# EAGLE design SmartMatrixPhotonApa (EAGLE 7.4.0)
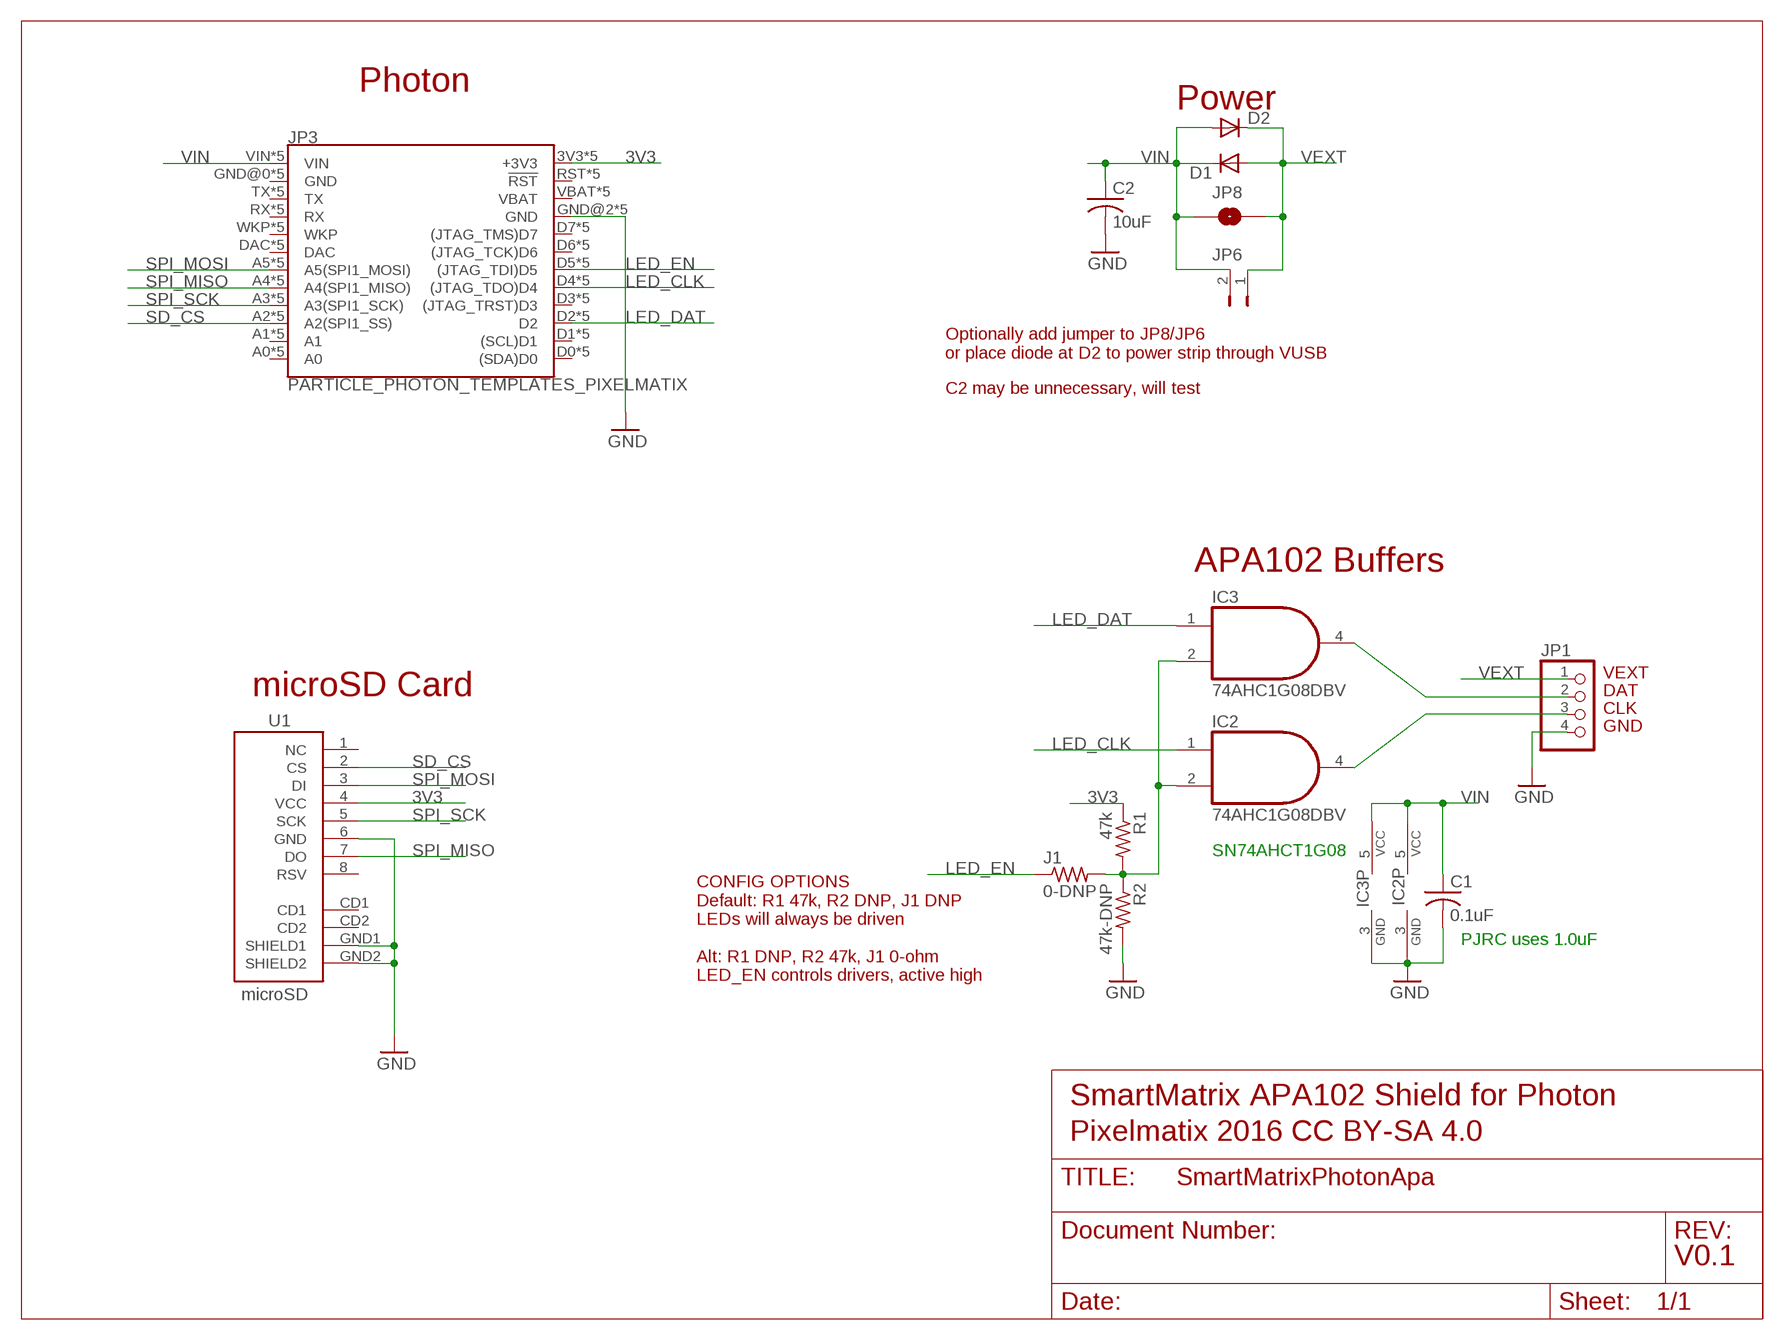
[diagram p0: schematic, sheet 1]

## Parts
C1  0.1uF  C-USC0603  [C0603]
C2  10uF  C-USC0805  [C0805]
D1  MBR0520LT  [SOD123]
D2  MBR0520LT  [SOD123]
IC2  74AHC1G08DBV  [SOT23-5]
IC3  74AHC1G08DBV  [SOT23-5]
J1  0-DNP  R-US_R0603  [R0603]
JP1  PINHD-1X04_2.54  [1X04]
JP3  PARTICLE_PHOTON_TEMPLATES_PIXELMATIX  [PIXELMATIX_PHOTON_SHIELD_TEMPLATE]
JP6  JUMPER-PTH-2-NO  [PTH-JUMPER-2-NO_NO_SILK]
JP8  JUMPER-PAD-2-NO  [PAD-JUMPER-2-NO_NO_SILK]
R1  47k  R-US_R0603  [R0603]
R2  47k-DNP  R-US_R0603  [R0603]
U1  microSD  USD-SOCKETSMD  [MICRO-SD-SOCKET-PP]

## Nets
3V3: JP3.3V3(+3V3) JP3.3V3_1(+3V3) JP3.3V3_2(+3V3) JP3.3V3_S1(+3V3) JP3.3V3_S2(+3V3) R1.1 U1.4(VCC)
CLK: IC2.4(O) JP1.3
DAT: IC3.4(O) JP1.2
GND: C1.2 C2.2 IC2.3(GND) IC3.3(GND) JP1.4 JP3.GND@2(GND) JP3.GND@2_1(GND) JP3.GND@2_2(GND) JP3.GND@2_S1(GND) JP3.GND@2_S2(GND) R2.2 U1.6(GND) U1.GND1(SHIELD1) U1.GND2(SHIELD2)
LED_CLK: IC2.1(I0) JP3.D4((JTAG_TDO)D4) JP3.D4_1((JTAG_TDO)D4) JP3.D4_2((JTAG_TDO)D4) JP3.D4_S1((JTAG_TDO)D4) JP3.D4_S2((JTAG_TDO)D4)
LED_DAT: IC3.1(I0) JP3.D2 JP3.D2_1(D2) JP3.D2_2(D2) JP3.D2_S1(D2) JP3.D2_S2(D2)
LED_EN: J1.1 JP3.D5((JTAG_TDI)D5) JP3.D5_1((JTAG_TDI)D5) JP3.D5_2((JTAG_TDI)D5) JP3.D5_S1((JTAG_TDI)D5) JP3.D5_S2((JTAG_TDI)D5)
N$4: IC2.2(I1) IC3.2(I1) J1.2 R1.2 R2.1
SD_CS: JP3.A2(A2(SPI1_SS)) JP3.A2_1(A2(SPI1_SS)) JP3.A2_2(A2(SPI1_SS)) JP3.A2_S1(A2(SPI1_SS)) JP3.A2_S2(A2(SPI1_SS)) U1.2(CS)
SPI_MISO: JP3.A4(A4(SPI1_MISO)) JP3.A4_1(A4(SPI1_MISO)) JP3.A4_2(A4(SPI1_MISO)) JP3.A4_S1(A4(SPI1_MISO)) JP3.A4_S2(A4(SPI1_MISO)) U1.7(DO)
SPI_MOSI: JP3.A5(A5(SPI1_MOSI)) JP3.A5_1(A5(SPI1_MOSI)) JP3.A5_2(A5(SPI1_MOSI)) JP3.A5_S1(A5(SPI1_MOSI)) JP3.A5_S2(A5(SPI1_MOSI)) U1.3(DI)
SPI_SCK: JP3.A3(A3(SPI1_SCK)) JP3.A3_1(A3(SPI1_SCK)) JP3.A3_2(A3(SPI1_SCK)) JP3.A3_S1(A3(SPI1_SCK)) JP3.A3_S2(A3(SPI1_SCK)) U1.5(SCK)
VEXT [power]: D1.A D2.C JP1.1 JP6.1 JP8.2
VIN [power]: C1.1 C2.1 D1.C D2.A IC2.5(VCC) IC3.5(VCC) JP3.VIN JP3.VIN1(VIN) JP3.VIN2(VIN) JP3.VIN_S1(VIN) JP3.VIN_S2(VIN) JP6.2 JP8.1
Unconnected: JP3.A0 JP3.A0_1(A0) JP3.A0_2(A0) JP3.A0_S1(A0) JP3.A0_S2(A0) JP3.A1 JP3.A1_1(A1) JP3.A1_2(A1) JP3.A1_S1(A1) JP3.A1_S2(A1) JP3.D0((SDA)D0) JP3.D0_1((SDA)D0) JP3.D0_2((SDA)D0) JP3.D0_S1((SDA)D0) JP3.D0_S2((SDA)D0) JP3.D1((SCL)D1) JP3.D1_1((SCL)D1) JP3.D1_2((SCL)D1) JP3.D1_S1((SCL)D1) JP3.D1_S2((SCL)D1) JP3.D3((JTAG_TRST)D3) JP3.D3_1((JTAG_TRST)D3) JP3.D3_2((JTAG_TRST)D3) JP3.D3_S1((JTAG_TRST)D3) JP3.D3_S2((JTAG_TRST)D3) JP3.D6((JTAG_TCK)D6) JP3.D6_1((JTAG_TCK)D6) JP3.D6_2((JTAG_TCK)D6) JP3.D6_S1((JTAG_TCK)D6) JP3.D6_S2((JTAG_TCK)D6) JP3.D7((JTAG_TMS)D7) JP3.D7_1((JTAG_TMS)D7) JP3.D7_2((JTAG_TMS)D7) JP3.D7_S1((JTAG_TMS)D7) JP3.D7_S2((JTAG_TMS)D7) JP3.DAC JP3.DAC_1(DAC) JP3.DAC_2(DAC) JP3.DAC_S1(DAC) JP3.DAC_S2(DAC) JP3.GND@0(GND) JP3.GND@0_1(GND) JP3.GND@0_2(GND) JP3.GND@0_S1(GND) JP3.GND@0_S2(GND) JP3.RST(!RST!) JP3.RST_1(!RST!) JP3.RST_2(!RST!) JP3.RST_S1(!RST!) JP3.RST_S2(!RST!) JP3.RX JP3.RX_1(RX) JP3.RX_2(RX) JP3.RX_S1(RX) JP3.RX_S2(RX) JP3.TX JP3.TX_1(TX) JP3.TX_2(TX) JP3.TX_S1(TX) JP3.TX_S2(TX) JP3.VBAT JP3.VBAT_1(VBAT) JP3.VBAT_2(VBAT) JP3.VBAT_S1(VBAT) JP3.VBAT_S2(VBAT) JP3.WKP JP3.WKP_1(WKP) JP3.WKP_2(WKP) JP3.WKP_S1(WKP) JP3.WKP_S2(WKP) U1.1(NC) U1.8(RSV) U1.CD1 U1.CD2

## Notes on the sheet
- Photon
- Power
- Optionally add jumper to JP8/JP6
  or place diode at D2 to power strip through VUSB
- C2 may be unnecessary, will test
- APA102 Buffers
- VEXT
- microSD Card | DAT
- CLK
- GND
- SN74AHCT1G08
- PJRC uses 1.0uF
- CONFIG OPTIONS
  Default: R1 47k, R2 DNP, J1 DNP
  LEDs will always be driven
  
  Alt: R1 DNP, R2 47k, J1 0-ohm
  LED_EN controls drivers, active high
- SmartMatrix APA102 Shield for Photon
- Pixelmatix 2016 CC BY-SA 4.0
- V0.1

## Library data of the parts
C1 C2 = scanlime:C-US: CAPACITOR, American symbol; PARTNO: CAP CER 0.1UF 10V 10% X7R 0805
D1 D2 = diode:MBR0520LT: SCHOTTKY BARRIER RECTIFIER Source: http://onsemi.com .. MBR0520LT1-D.pdf
IC2 IC3 = 74xx-little-us:74*1G08: 2-input AND gate
J1 R1 R2 = rcl:R-US_: RESISTOR, American symbol
JP1 = pinhead-2:PINHD-1X04: PIN HEADER
JP3 = eclibrary:PARTICLE_PHOTON_TEMPLATES
JP6 = SparkFun-Passives:JUMPER-PTH-2-NO
JP8 = SparkFun-Passives:JUMPER-PAD-2-NO
U1 = SparkFun:USD-SOCKET: microSD Socket Push-push type uSD socket. Schematic element and footprint production proven. Spark Fun Electronics SKU : PRT-00127. tDoc lines correctly indicate media card edge positions when inserting (unlocked, locked, depressed).

## Net classes
1 power: width 0.406 mm

## Board
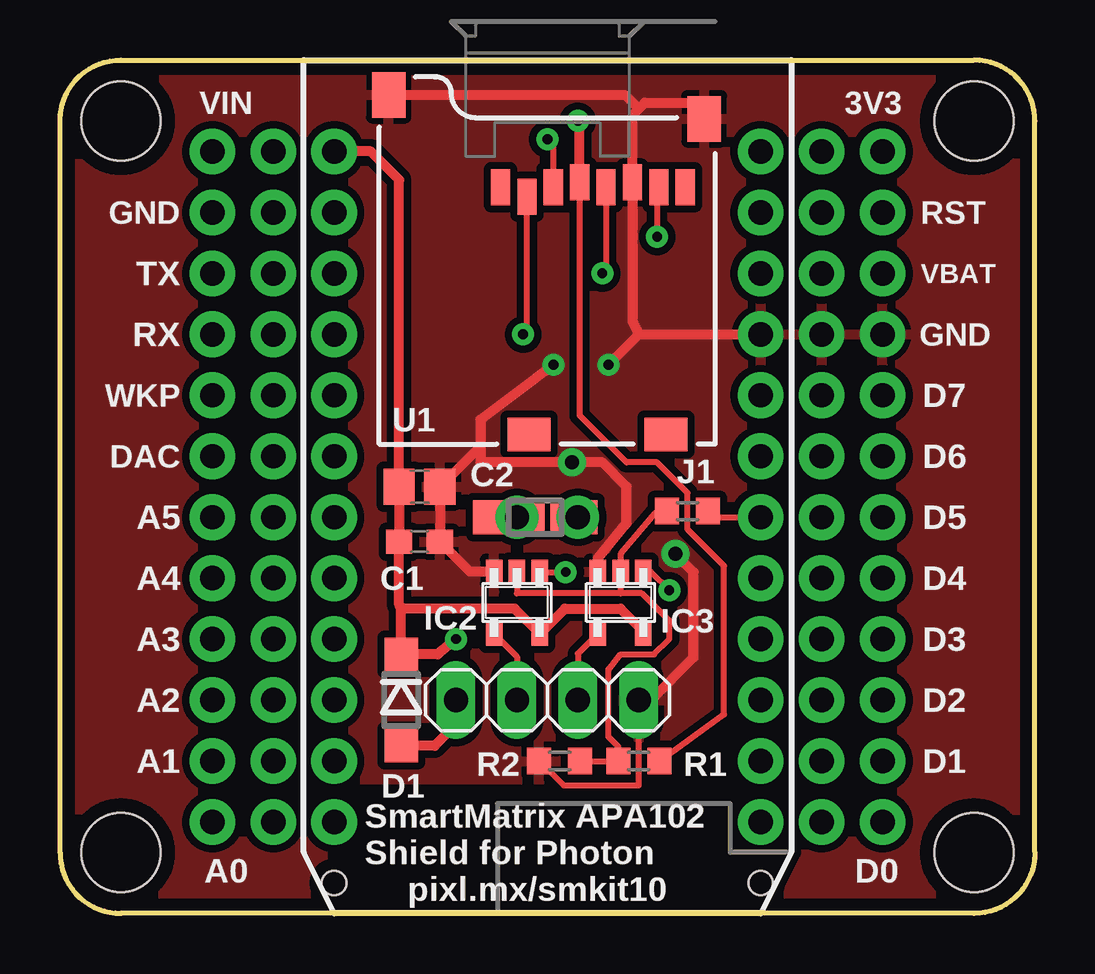
[diagram p1: board, top side]
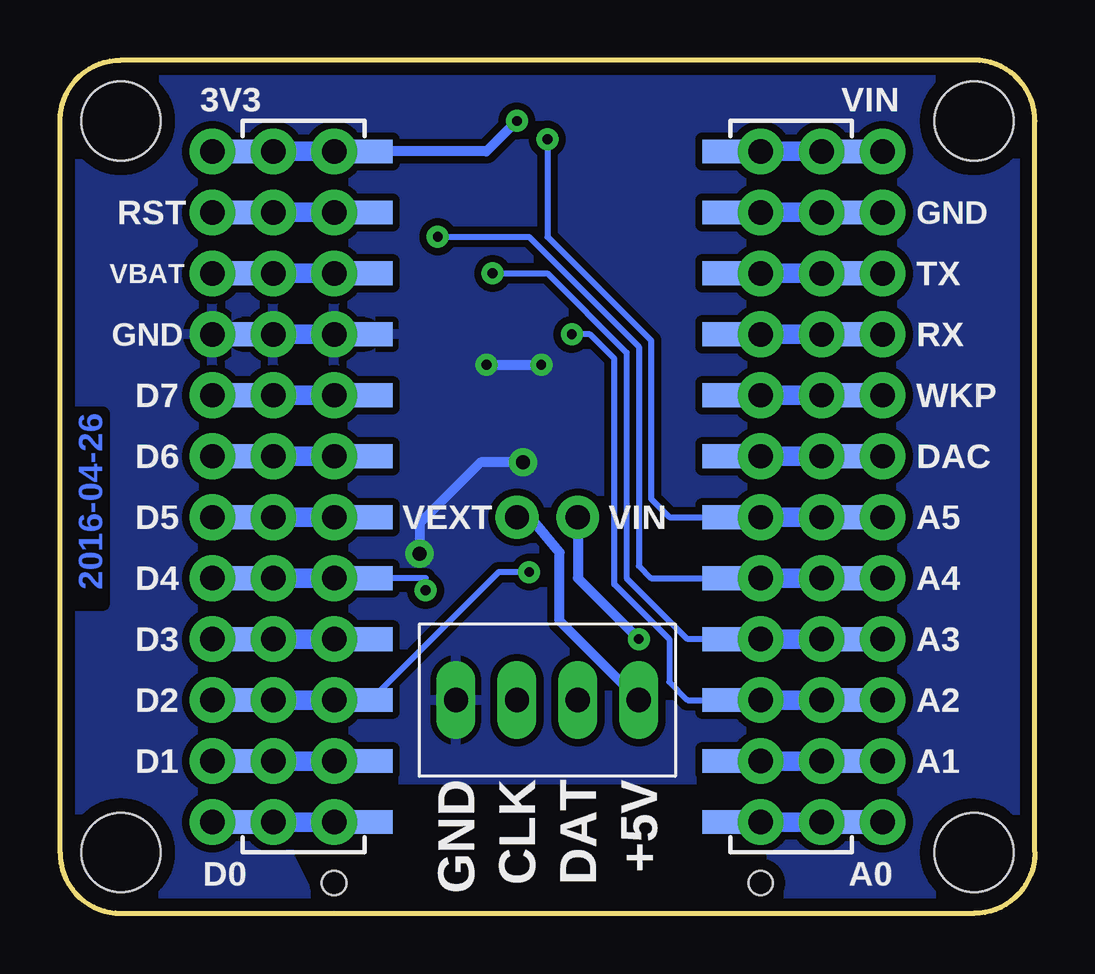
[diagram p2: board, bottom side, seen from below]

Size 40.64 x 35.57 mm. Coordinates in mm from the lower left corner, seen from the top.
Outline: 11.43,0 29.21,0.01
Outline: 2.54,35.57 38.1,35.57 arc-90 40.64,33.03 40.64,2.55 arc-90 38.1,0.01 2.54,0.01 arc-90 0,2.55 0,33.03 arc-90 2.54,35.57
Copper layers (1*16): Top 0.035mm / dielectric 1.5mm / Bottom 0.035mm
Design rules "SmartProto-Manual-(Recommended) *": minimum track width 6mil, minimum drill 12mil, track to track 10mil, track to pad 6mil, pad to pad 12mil, via to via 8mil, smd to smd 0mil, copper to edge 20mil, drill to drill 20mil, minimum pad ring 12mil, minimum via ring 10mil, stop-mask expansion 2mil, vias tented up to drill 25mil, thermal gap 10mil

### Footprints (pad centres in the part's own frame; a part is rotated, then mirrored left to right if it is on the bottom)
C0603 = smd 1.1 x 1: 1 -0.85,0; 2 0.85,0
C0805 = smd 1.3 x 1.5: 1 -0.85,0; 2 0.85,0
SOD123 = smd 1.4 x 1.4: A 1.9,0; C -1.9,0
SOT23-5 = smd 0.69 x 0.99: 1 -0.95,-1.29; 2 0,-1.29; 3 0.95,-1.29; 4 0.95,1.3; 5 -0.95,1.3
R0603 = smd 1 x 1.1: 1 -0.85,0; 2 0.85,0
1X04 = drill 1.016 long: 1 -3.81,0; 2 -1.27,0; 3 1.27,0; 4 3.81,0
PIXELMATIX_PHOTON_SHIELD_TEMPLATE = drill 1.016 pad 1.905: 3V3 24.13,31.75; 3V3_1 21.59,31.75; 3V3_2 19.05,31.75; A0 -3.81,3.81; A0_1 -1.27,3.81; A0_2 1.27,3.81; A1 -3.81,6.35; A1_1 -1.27,6.35; A1_2 1.27,6.35; A2 -3.81,8.89; A2_1 -1.27,8.89; A2_2 1.27,8.89; A3 -3.81,11.43; A3_1 -1.27,11.43; A3_2 1.27,11.43; A4 -3.81,13.97; A4_1 -1.27,13.97; A4_2 1.27,13.97; A5 -3.81,16.51; A5_1 -1.27,16.51; A5_2 1.27,16.51; D0 24.13,3.81; D0_1 21.59,3.81; D0_2 19.05,3.81; D1 24.13,6.35; D1_1 21.59,6.35; D1_2 19.05,6.35; D2 24.13,8.89; D2_1 21.59,8.89; D2_2 19.05,8.89; D3 24.13,11.43; D3_1 21.59,11.43; D3_2 19.05,11.43; D4 24.13,13.97; D4_1 21.59,13.97; D4_2 19.05,13.97; D5 24.13,16.51; D5_1 21.59,16.51; D5_2 19.05,16.51; D6 24.13,19.05; D6_1 21.59,19.05; D6_2 19.05,19.05; D7 24.13,21.59; D7_1 21.59,21.59; D7_2 19.05,21.59; DAC -3.81,19.05; DAC_1 -1.27,19.05; DAC_2 1.27,19.05; GND@0 -3.81,29.21; GND@0_1 -1.27,29.21; GND@0_2 1.27,29.21; GND@2 24.13,24.13; GND@2_1 21.59,24.13; GND@2_2 19.05,24.13; RST 24.13,29.21; RST_1 21.59,29.21; RST_2 19.05,29.21; RX -3.81,24.13; RX_1 -1.27,24.13; RX_2 1.27,24.13; TX -3.81,26.67; TX_1 -1.27,26.67; TX_2 1.27,26.67; VBAT 24.13,26.67; VBAT_1 21.59,26.67; VBAT_2 19.05,26.67; VIN -3.81,31.75; VIN1 -1.27,31.75; VIN2 1.27,31.75; WKP -3.81,21.59; WKP_1 -1.27,21.59; WKP_2 1.27,21.59 | smd 1.829 x 0.991 bottom: 3V3_S1 23.114,31.75; 3V3_S2 17.526,31.75; A0_S1 -2.794,3.81; A0_S2 2.794,3.81; A1_S1 -2.794,6.35; A1_S2 2.794,6.35; A2_S1 -2.794,8.89; A2_S2 2.794,8.89; A3_S1 -2.794,11.43; A3_S2 2.794,11.43; A4_S1 -2.794,13.97; A4_S2 2.794,13.97; A5_S1 -2.794,16.51; A5_S2 2.794,16.51; D0_S1 23.114,3.81; D0_S2 17.526,3.81; D1_S1 23.114,6.35; D1_S2 17.526,6.35; D2_S1 23.114,8.89; D2_S2 17.526,8.89; D3_S1 23.114,11.43; D3_S2 17.526,11.43; D4_S1 23.114,13.97; D4_S2 17.526,13.97; D5_S1 23.114,16.51; D5_S2 17.526,16.51; D6_S1 23.114,19.05; D6_S2 17.526,19.05; D7_S1 23.114,21.59; D7_S2 17.526,21.59; DAC_S1 -2.794,19.05; DAC_S2 2.794,19.05; GND@0_S1 -2.794,29.21; GND@0_S2 2.794,29.21; GND@2_S1 23.114,24.13; GND@2_S2 17.526,24.13; RST_S1 23.114,29.21; RST_S2 17.526,29.21; RX_S1 -2.794,24.13; RX_S2 2.794,24.13; TX_S1 -2.794,26.67; TX_S2 2.794,26.67; VBAT_S1 23.114,26.67; VBAT_S2 17.526,26.67; VIN_S1 -2.794,31.75; VIN_S2 2.794,31.75; WKP_S1 -2.794,21.59; WKP_S2 2.794,21.59 | hole 3.302: -7.62,33.02; 27.94,33.02; -7.62,2.54; 27.94,2.54 | hole 1.016: 1.27,1.27; 19.05,1.27
PTH-JUMPER-2-NO_NO_SILK = drill 1.016 pad 1.778: 1 -1.27,0; 2 1.27,0
PAD-JUMPER-2-NO_NO_SILK = smd 0.635 x 1.27: 1 -0.45,0; 2 0.45,0
MICRO-SD-SOCKET-PP = smd 0.8 x 1.5: 1 -8.94,10.7; 2 -7.84,10.3; 3 -6.74,10.7; 4 -5.64,10.9; 5 -4.54,10.7; 6 -3.44,10.9; 7 -2.34,10.7; 8 -1.24,10.7 | smd 1.8 x 1.4: CD1 -7.75,0.4; CD2 -2.05,0.4 | smd 1.4 x 1.9: GND1 -13.6,14.55; GND2 -0.45,13.55

### Placement (x,y rotation side)
C1  14.99,15.5 0 top
C2  14.99,17.79 0 top
D1  14.22,8.9 270 top
D2  19.81,16.52 180 top
IC2  23.37,12.96 180 top
IC3  19.05,12.96 180 top
J1  26.16,16.77 180 top
JP1  20.32,8.9 0 top
JP3  10.16,0.01 0 top
JP6  20.32,16.52 180 top
JP8  20.32,16.52 0 top
R1  24.13,6.36 180 top
R2  20.83,6.36 180 top
U1  27.3,19.57 0 top

### Tracks (layer width: path | path; a pad name or v marks a point on that pad's centre or on a via)
3V3  (via drill 0.41)
  Top 0.254: U1.4 21.66,20.76 23.62,18.81 24.89,18.81 26.16,17.54 26.16,16.01 27.69,14.49 27.69,8.3 R1.1
  Top 0.406: U1.4 21.66,32.95 v21.59,33.03
  Bottom 0.406: v21.59,33.03 22.86,31.76 JP3.3V3_S2 JP3.3V3_2 JP3.3V3_1 JP3.3V3_S1 JP3.3V3
CLK
  Top 0.254: IC2.4 21.59,10.84 JP1.3
DAT
  Top 0.254: IC3.4 19.05,10.71 JP1.2
GND  (via drill 0.41, 0.58 pad 0.58)
  Top 0.254: R2.2 20.99,5.34 24.13,5.34 JP1.4
  Top 0.406: 24.13,24.14 23.86,24.66 U1.6 23.86,33.27 24.13,33.54 | 24.13,24.14 JP3.GND@2_2 | 24.13,33.54 24.38,33.79 26.77,33.79 U1.GND2 | U1.GND1 23.55,34.12 24.13,33.54 | 24.13,24.14 v22.86,22.87 | v20.57,22.87 17.53,20.58 17.53,19.48 | IC2.3 22.42,14.81 23.62,16.27 23.62,17.79 22.61,18.81 v21.34,18.81 17.53,18.81 17.53,19.48 | JP1.4 24.64,8.9 26.42,10.68 26.42,14.23 v25.65,15 | 17.53,19.48 C2.2 C1.2 17.09,14.25 IC3.3
  Bottom 0.406: v22.86,22.87 v20.57,22.87 | JP3.GND@2_1 JP3.GND@2_S1 JP3.GND@2 | JP3.GND@2_S2 JP3.GND@2_2 | v21.34,18.81 23.11,18.81 25.65,16.27 v25.65,15
  pour Bottom (isolate 0.305): 0,35.57 40.64,35.57 40.64,0.01 0,0.01
  pour Top (isolate 0.305): 0,35.57 40.64,35.57 40.64,0.01 0,0.01
LED_CLK  (via drill 0.41)
  Top 0.254: IC2.1 24.62,14.25 v25.4,13.47
  Bottom 0.254: v25.4,13.47 25.4,13.98 28.7,13.98
  Bottom 0.406: JP3.D4_S2 28.7,13.98 JP3.D4_2 JP3.D4_1 JP3.D4_S1 JP3.D4
LED_DAT  (via drill 0.41)
  Top 0.254: IC3.1 20.02,14.23 v21.08,14.23
  Bottom 0.254: v21.08,14.23 22.35,14.23 JP3.D2_S2
  Bottom 0.406: JP3.D2_S2 JP3.D2_2 JP3.D2_1 JP3.D2_S1 JP3.D2
LED_EN
  Top 0.254: J1.1 27.43,16.52 JP3.D5_2
  Bottom 0.406: JP3.D5 JP3.D5_S1 JP3.D5_1 | JP3.D5_1 31.5,16.52 | JP3.D5_S2 JP3.D5_2 JP3.D5_1
N$4
  Top 0.254: 23.37,14.49 IC2.2 | IC2.2 23.37,13.35 | 23.37,13.35 19.05,13.35 IC3.2 | J1.2 24.8,16.69 23.37,15 IC2.2 | 23.37,13.35 24.26,13.35 25.4,12.2 25.4,11.44 24.77,10.8 23.37,10.8 22.86,10.17 22.86,7.38 23.28,6.96 R1.2 R2.1
SD_CS  (via drill 0.41)
  Top 0.254: 19.46,24.3 U1.2
  Top 0.406: v19.3,24.14 19.46,24.3
  Bottom 0.254: v19.3,24.14 18.54,24.14 17.53,23.12 17.53,13.73 15.24,11.44 15.24,9.66 14.48,8.9 JP3.A2_S2
  Bottom 0.406: JP3.A2 JP3.A2_S1 JP3.A2_1 JP3.A2_2 JP3.A2_S2
SPI_MISO  (via drill 0.41)
  Top 0.254: U1.7 24.89,30.2 v24.89,28.2
  Bottom 0.254: JP3.A4_2 JP3.A4_S2 16,13.98 16.51,14.49 16.51,23.63 21.08,28.2 v24.89,28.2
  Bottom 0.406: JP3.A4 JP3.A4_S1 JP3.A4_1 JP3.A4_2
SPI_MOSI  (via drill 0.41)
  Top 0.254: U1.3 20.57,32.02 v20.32,32.27
  Bottom 0.254: v20.32,32.27 20.32,28.2 16,23.89 16,17.28 15.24,16.52 JP3.A5_S2
  Bottom 0.406: JP3.A5 JP3.A5_S1 JP3.A5_1 JP3.A5_2 JP3.A5_S2
SPI_SCK  (via drill 0.41)
  Top 0.254: U1.5 22.77,26.84 v22.61,26.68
  Bottom 0.254: JP3.A3_S2 14.48,11.44 17.02,13.98 17.02,23.38 20.32,26.68 v22.61,26.68
  Bottom 0.406: JP3.A3 JP3.A3_S1 JP3.A3_1 JP3.A3_2 JP3.A3_S2
VEXT
  Top 0.406: JP8.2 JP6.1 D2.C | JP1.1 16.51,7.88 15.62,7 D1.A
  Bottom 0.406: JP1.1 19.81,12.2 19.81,15.05 21.02,16.52 JP6.1
VIN  (via drill 0.41)
  Top 0.406: 14.22,12.71 D1.C 15.75,10.8 v16.51,11.44 | 14.22,12.71 18.95,12.71 IC3.5 21.05,12.71 23.37,12.71 24.32,11.76 IC2.5 | 14.22,12.71 14.14,12.88 C1.1 C2.1 14.14,30.58 JP3.VIN_S2 JP3.VIN2 | JP8.1 JP6.2 D2.A
  Bottom 0.406: JP3.VIN JP3.VIN_S1 JP3.VIN1 JP3.VIN2 JP3.VIN_S2 | JP6.2 19.05,13.98 v16.51,11.44

### Text on the board
Bottom: 2016-04-26
tPlace: IC2 | IC3 | SmartMatrix APA102 / Shield for Photon | pixl.mx/smkit10
bPlace: VIN | VEXT | +5V | DAT | CLK | GND
Document: SmartMatrix APA102 Shield for Photon | Pixelmatix 2016 CC BY-SA 4.0 | Rev V0.1 | Photon Shield Footprint originally by SparkFun, CC BY-SA 4.0 | Photon SMT Breakout Footprint originally by Particle